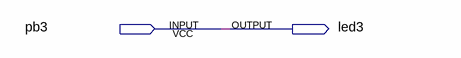
[diagram p0: schematic sheet]
// Quartus schematic cyclone10_sandbox.bdf as structural Verilog: 0 symbols, 2 pins
module cyclone10_sandbox (
  input  pb3,
  output led3
);


  assign led3 = pb3;
endmodule
